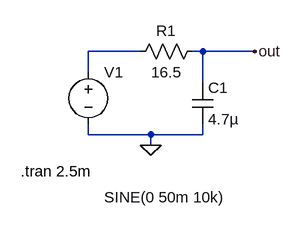
[diagram p0: schematic low_pass_filter.asc]
low_pass_filter.asc, the LTspice schematic file:
Version 4
SHEET 1 880 680
WIRE 160 112 80 112
WIRE 256 112 240 112
WIRE 336 112 256 112
WIRE 80 144 80 112
WIRE 256 160 256 112
WIRE 80 240 80 224
WIRE 176 240 80 240
WIRE 256 240 256 224
WIRE 256 240 176 240
WIRE 176 256 176 240
FLAG 176 256 0
FLAG 336 112 out
SYMBOL cap 240 160 R0
SYMATTR InstName C1
SYMATTR Value 4.7µ
SYMBOL res 256 96 R90
WINDOW 0 0 56 VBottom 2
WINDOW 3 32 56 VTop 2
SYMATTR InstName R1
SYMATTR Value 16.5
SYMBOL voltage 80 128 R0
WINDOW 3 24 208 Left 2
WINDOW 123 24 180 Left 2
WINDOW 39 0 0 Left 0
SYMATTR Value SINE(0 50m 10k)
SYMATTR InstName V1
TEXT -24 296 Left 2 !.tran 2.5m

The netlist it stands for:
* low_pass_filter.asc
C1 out 0 4.7µ
R1 out N001 16.5
V1 N001 0 SINE(0 50m 10k)
.tran 2.5m
.backanno
.end